# Altium schematic sheet 02.PMIC PMU.SchDoc
size A3; SheetNumber: 2; SheetTotal: 10
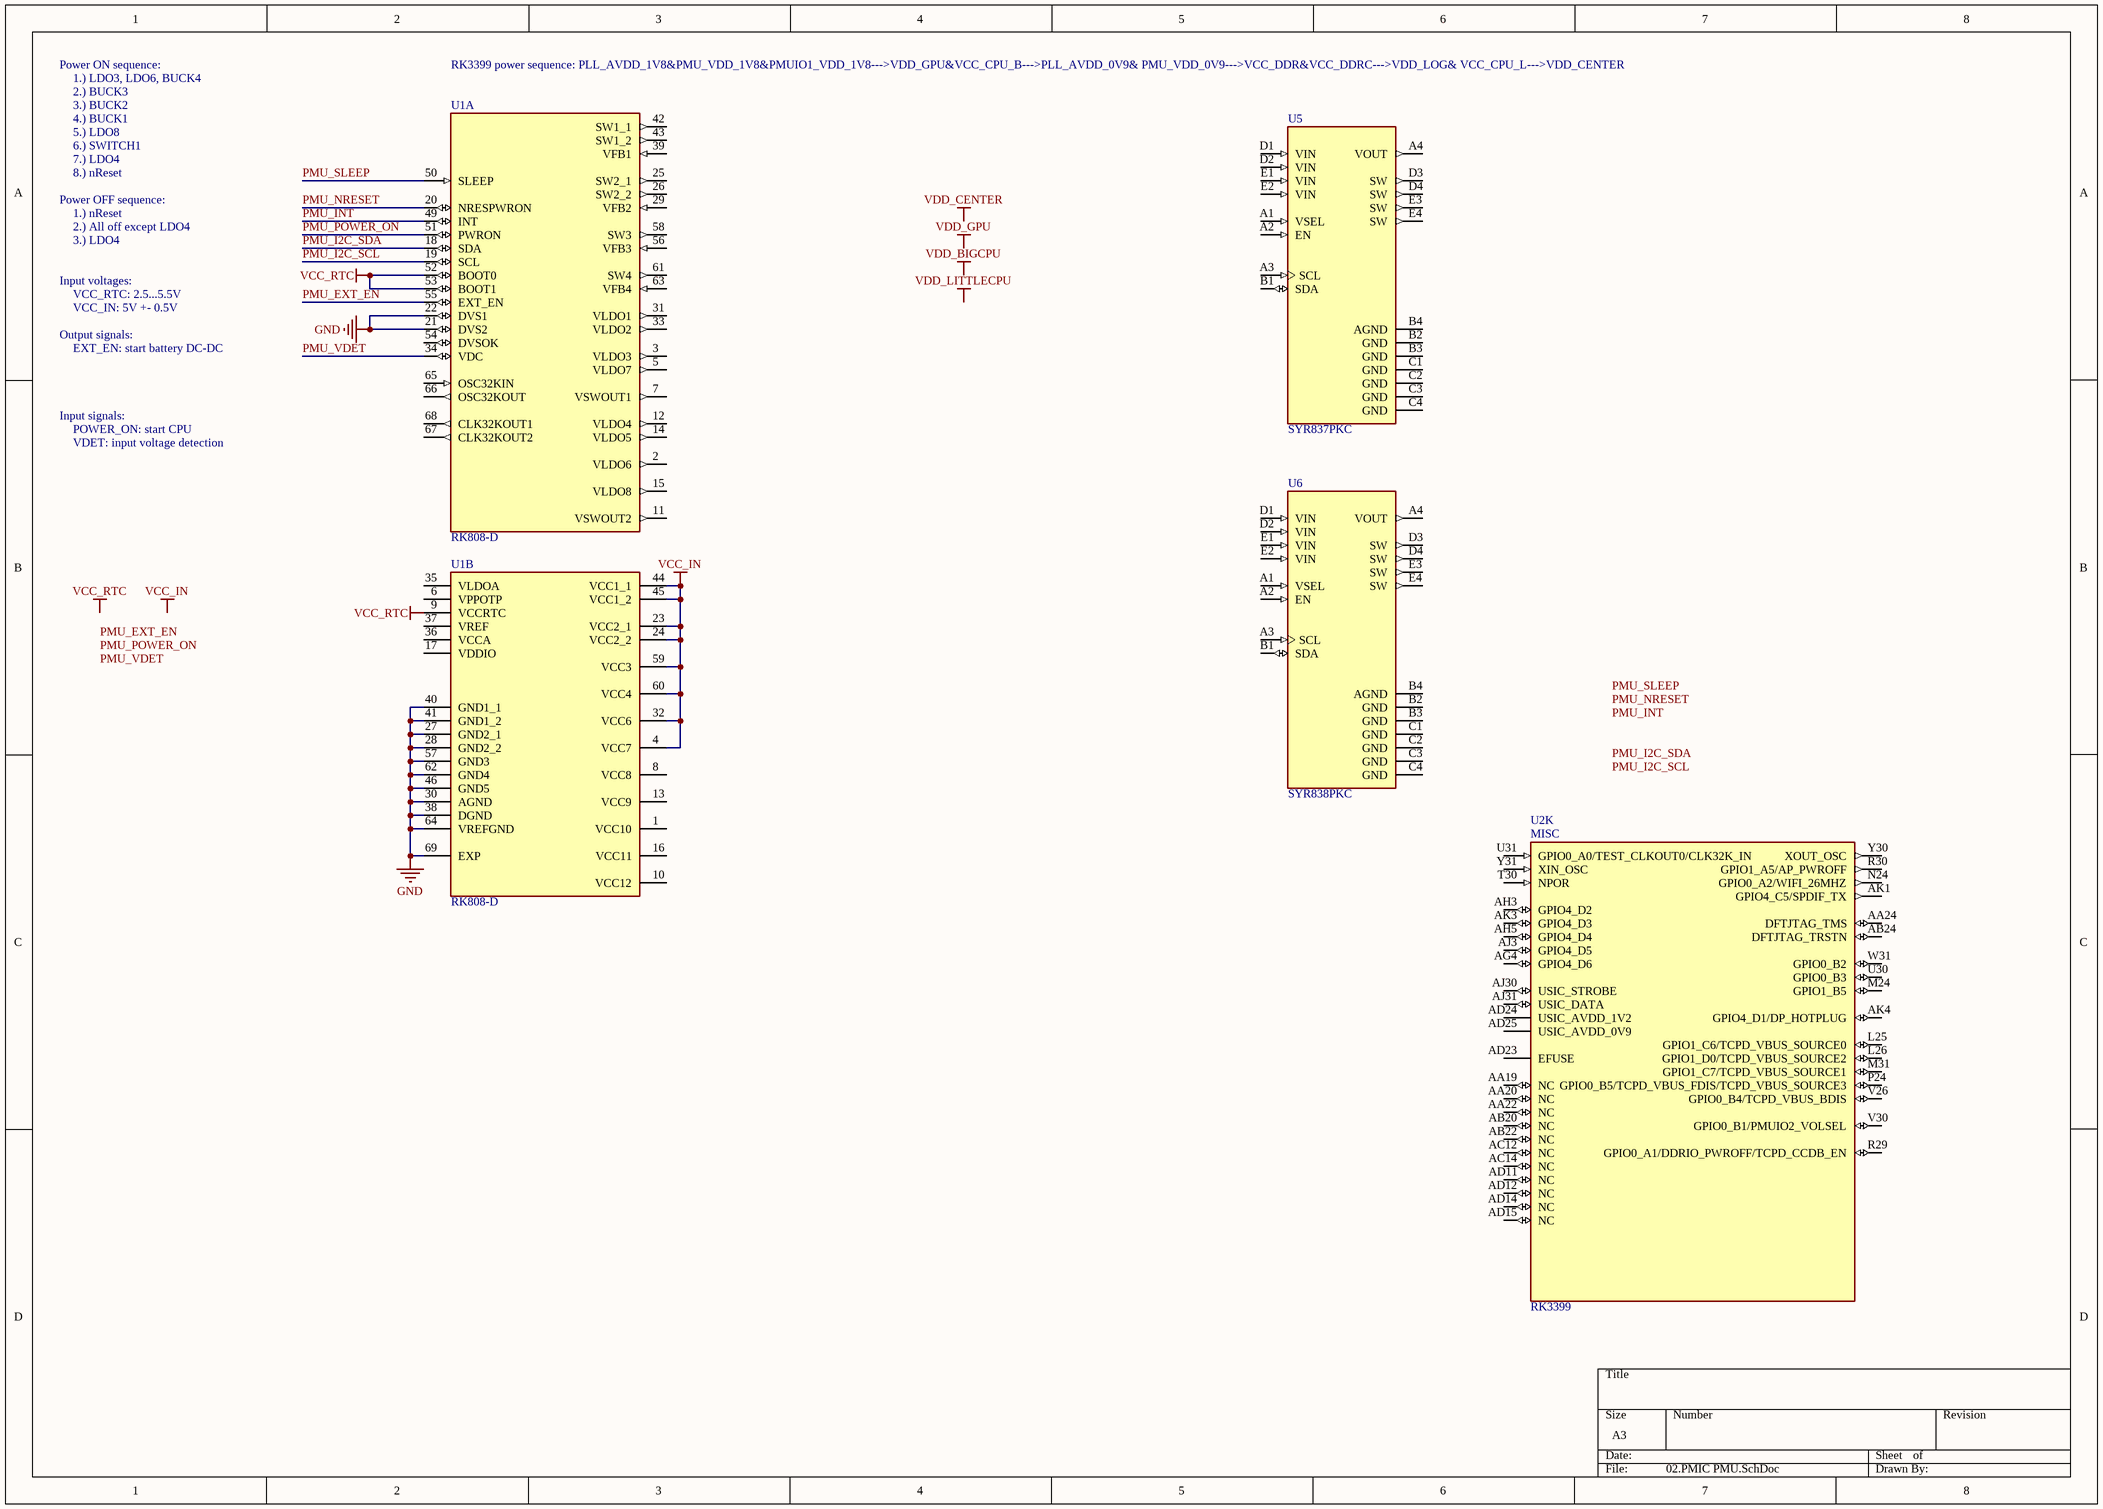
[diagram p0: 02.PMIC PMU.SchDoc]

## Parts
U1  RK808-D  [QFN35P700X700X80-69N]  (parts A,B of 2)
U2  RK3399  [BGA828C65P31X31_2100X2100X161N]  (part K of 32)
U5  SYR837PKC  [BGA20N40P5X4_196X156X66N]
U6  SYR838PKC  [BGA20N40P5X4_196X156X66N]

## Nets
GND: U1.21(DVS2) U1.22(DVS1) U1.27(GND2_1) U1.28(GND2_2) U1.30(AGND) U1.38(DGND) U1.40(GND1_1) U1.41(GND1_2) U1.46(GND5) U1.57(GND3) U1.62(GND4) U1.64(VREFGND) U1.69(EXP)
VCC_IN: U1.4(VCC7) U1.23(VCC2_1) U1.24(VCC2_2) U1.32(VCC6) U1.44(VCC1_1) U1.45(VCC1_2) U1.59(VCC3) U1.60(VCC4)
VCC_RTC: U1.9(VCCRTC) U1.52(BOOT0) U1.53(BOOT1)
PMU_EXT_EN: U1.55(EXT_EN)
PMU_I2C_SCL: U1.19(SCL)
PMU_I2C_SDA: U1.18(SDA)
PMU_INT: U1.49(INT)
PMU_NRESET: U1.20(NRESPWRON)
PMU_POWER_ON: U1.51(PWRON)
PMU_SLEEP: U1.50(SLEEP)
PMU_VDET: U1.34(VDC)

Not connected (* = marked no-connect by the designer): U1 1(VCC10) 2(VLDO6) 3(VLDO3) 5(VLDO7) 6(VPPOTP) 7(VSWOUT1) 8(VCC8) 10(VCC12) 11(VSWOUT2) 12(VLDO4) 13(VCC9) 14(VLDO5) 15(VLDO8) 16(VCC11) 17(VDDIO) 25(SW2_1) 26(SW2_2) 29(VFB2) 31(VLDO1) 33(VLDO2) 35(VLDOA) 36(VCCA) 37(VREF) 39(VFB1) 42(SW1_1) 43(SW1_2) 54(DVSOK) 56(VFB3) 58(SW3) 61(SW4) 63(VFB4) 65(OSC32KIN) 66(OSC32KOUT) 67(CLK32KOUT2) 68(CLK32KOUT1); U2 AA19(NC) AA20(NC) AA22(NC) AA24(DFTJTAG_TMS) AB20(NC) AB22(NC) AB24(DFTJTAG_TRSTN) AC12(NC) AC14(NC) AD11(NC) AD12(NC) AD14(NC) AD15(NC) AD23(EFUSE) AD24(USIC_AVDD_1V2) AD25(USIC_AVDD_0V9) AG4(GPIO4_D6) AH3(GPIO4_D2) AH5(GPIO4_D4) AJ3(GPIO4_D5) AJ30(USIC_STROBE) AJ31(USIC_DATA) AK1(GPIO4_C5/SPDIF_TX) AK3(GPIO4_D3) AK4(GPIO4_D1/DP_HOTPLUG) L25(GPIO1_C6/TCPD_VBUS_SOURCE0) L26(GPIO1_D0/TCPD_VBUS_SOURCE2) M24(GPIO1_B5) M31(GPIO1_C7/TCPD_VBUS_SOURCE1) N24(GPIO0_A2/WIFI_26MHZ) P24(GPIO0_B5/TCPD_VBUS_FDIS/TCPD_VBUS_SOURCE3) R29(GPIO0_A1/DDRIO_PWROFF/TCPD_CCDB_EN) R30(GPIO1_A5/AP_PWROFF) T30(NPOR) U30(GPIO0_B3) U31(GPIO0_A0/TEST_CLKOUT0/CLK32K_IN) V26(GPIO0_B4/TCPD_VBUS_BDIS) V30(GPIO0_B1/PMUIO2_VOLSEL) W31(GPIO0_B2) Y30(XOUT_OSC) Y31(XIN_OSC); U5 A1(VSEL) A2(EN) A3(SCL) A4(VOUT) B1(SDA) B2(GND) B3(GND) B4(AGND) C1(GND) C2(GND) C3(GND) C4(GND) D1(VIN) D2(VIN) D3(SW) D4(SW) E1(VIN) E2(VIN) E3(SW) E4(SW); U6 A1(VSEL) A2(EN) A3(SCL) A4(VOUT) B1(SDA) B2(GND) B3(GND) B4(AGND) C1(GND) C2(GND) C3(GND) C4(GND) D1(VIN) D2(VIN) D3(SW) D4(SW) E1(VIN) E2(VIN) E3(SW) E4(SW)

## Notes on the sheet
- Power ON sequence:
- 1.) LDO3, LDO6, BUCK4
- 2.) BUCK3
- 3.) BUCK2
- RK3399 power sequence: PLL_AVDD_1V8&PMU_VDD_1V8&PMUIO1_VDD_1V8--->VDD_GPU&VCC_CPU_B--->PLL_AVDD_0V9& PMU_VDD_0V9--->VCC_DDR&VCC_DDRC--->VDD_LOG& VCC_CPU_L--->VDD_CENTER
- 4.) BUCK1
- 5.) LDO8
- 6.) SWITCH1
- 7.) LDO4
- 8.) nReset
- Power OFF sequence:
- 1.) nReset
- 2.) All off except LDO4
- 3.) LDO4
- Input voltages:
- VCC_RTC: 2.5...5.5V
- VCC_IN: 5V +- 0.5V
- Output signals:
- EXT_EN: start battery DC-DC
- Input signals:
- POWER_ON: start CPU
- VDET: input voltage detection
- Labels drawn without touching a wire or pin: PMU_EXT_EN, PMU_I2C_SCL, PMU_I2C_SDA, PMU_INT, PMU_NRESET, PMU_POWER_ON, PMU_SLEEP, PMU_VDET, VCC_IN, VCC_RTC, VDD_BIGCPU, VDD_CENTER, VDD_GPU, VDD_LITTLECPU
- (in symbol RK3399, part K) MISC

## Library data of the parts
U1 = RK808-D: Power Management System; MF: Fuzhou Rockchip Electronics Co; Value: *; SnapEDA_Link: https://www.snapeda.com/parts/RK808-D/Fuzhou%20Rockchip%20Electronics%20Co/view-part/1600581/?ref=snap; Price: None; Availability: Unavailable; Package: None; MP: RK808-D
U2 = RK3399: RK3399 ROCK Pi 4 Model A 2GB - ARMÂ® CortexÂ®-A53, CortexÂ®-A72 MPU Embedded Evaluation Board; MF: Rockchip; SnapEDA_Link: https://www.snapeda.com/parts/RK3399/Fuzhou+Rockchip+Electronics+Co/view-part/?ref=snap; Package: Seeed Technology; MP: RK3399; Check_prices: https://www.snapeda.com/parts/RK3399/Fuzhou+Rockchip+Electronics+Co/view-part/?ref=eda; Price: None; Value: *; Availability: Not in stock
U5 U6 = SYR837PKC: SYR837/SYR838 is a high efficiency 2.4MHz synchronous step down DC/DC regulator IC capable of delivering up to 6A output currents.; MF: Silergy; SnapEDA_Link: https://www.snapeda.com/parts/SYR837PKC/Silergy/view-part/2756982/?ref=snap; Value: *; MP: SYR837PKC; Package: None; Price: None; Availability: Unavailable